# EAGLE design BGM111_A (EAGLE 7.5.0)
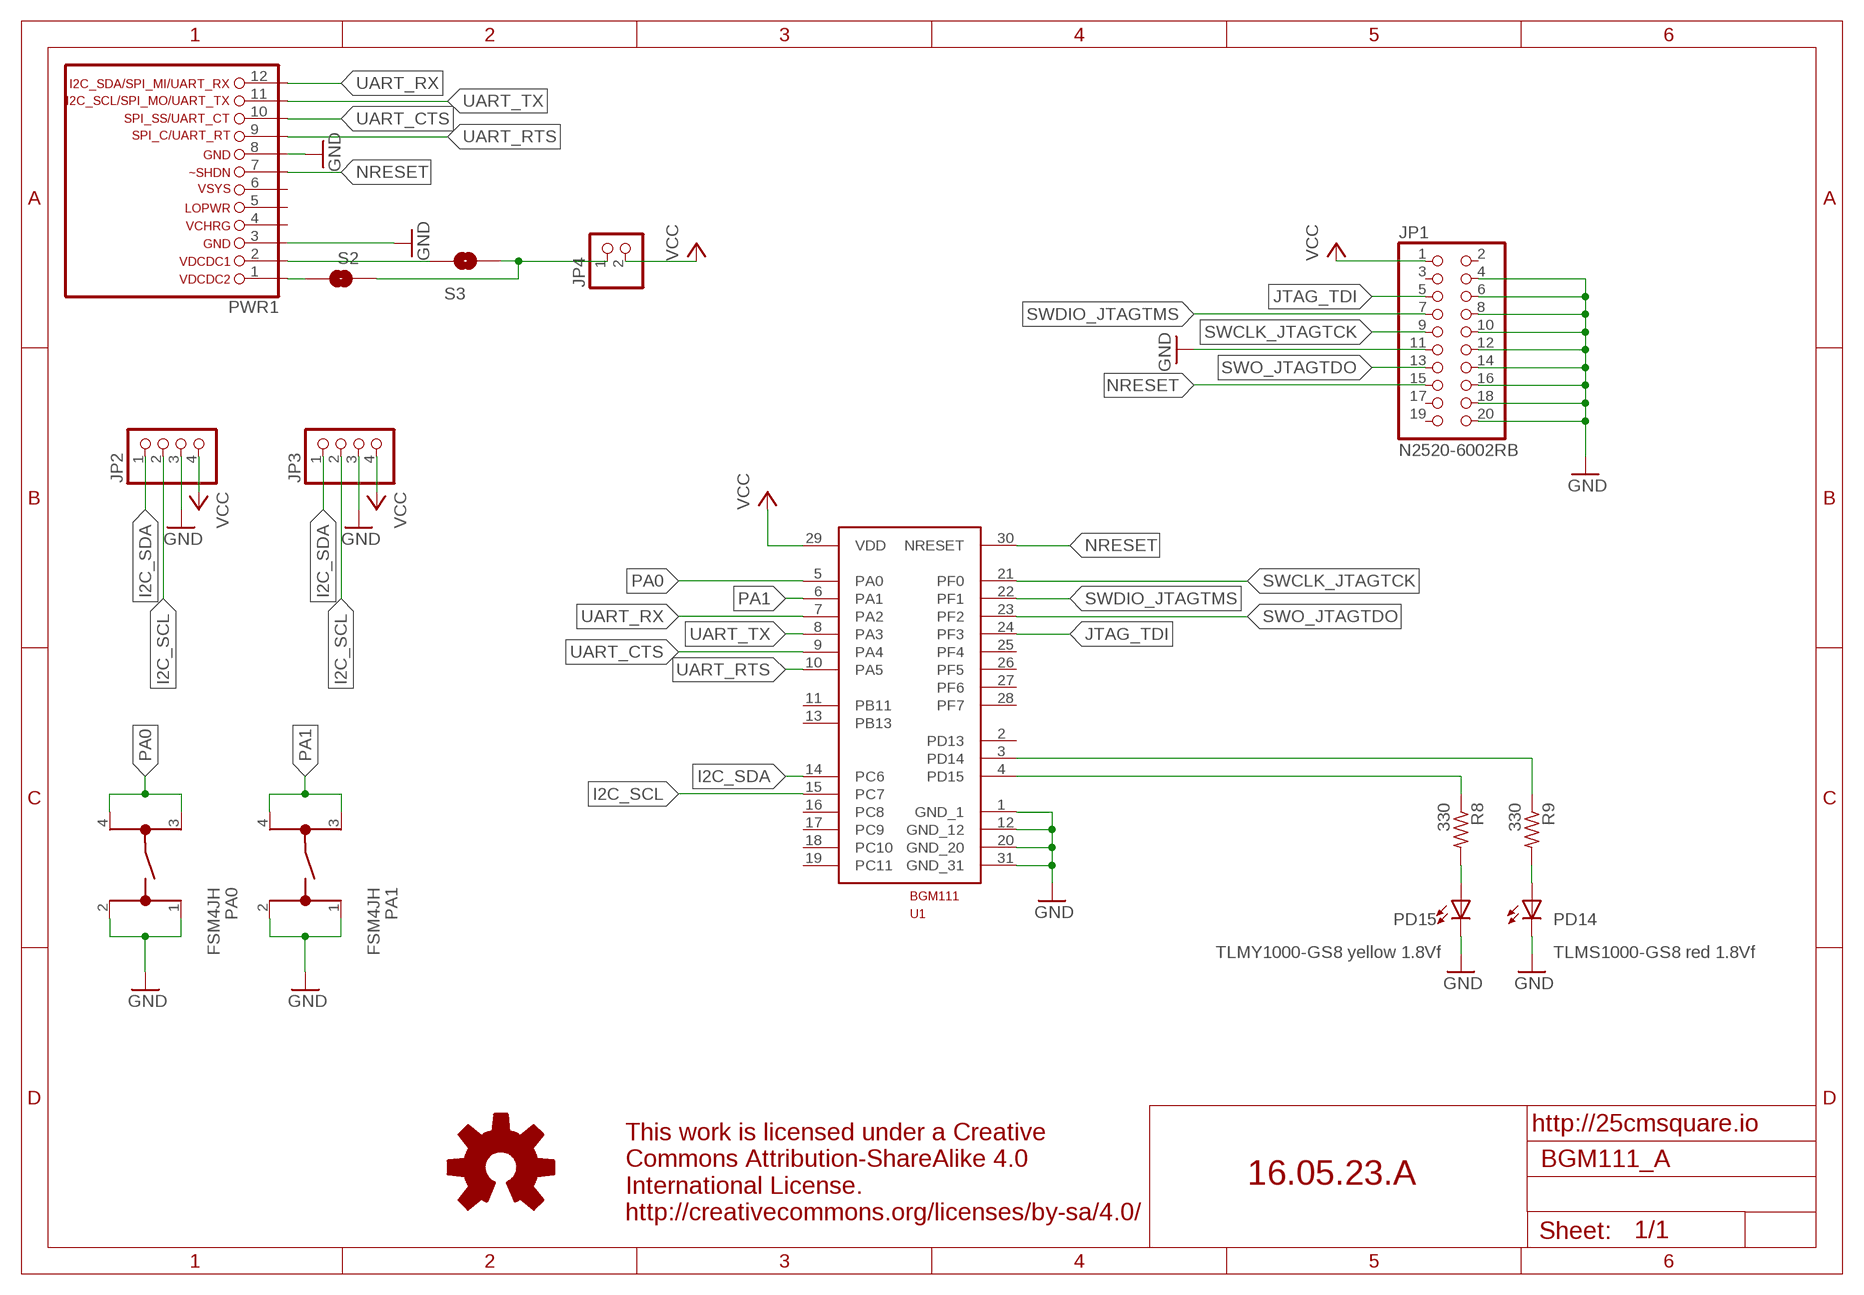
[diagram p0: schematic, sheet 1]

## Parts
JP1  N2520-6002RB  PINHD-2X10  [2X10]
JP2  PINHD-1X4  [1X04]
JP3  PINHD-1X4  [1X04]
JP4  PINHD-1X2  [1X02]
PA0  FSM4JH  [FSM4JH]
PA1  FSM4JH  [FSM4JH]
PD14  TLMS1000-GS8 red 1.8Vf  LEDSML0603  [SML0603]
PD15  TLMY1000-GS8 yellow 1.8Vf  LEDSML0603  [SML0603]
PWR1  LIWE_12_PIN_PWR  [LIWE_12_PIN]
R8  330  R-US_R0603  [R0603]
R9  330  R-US_R0603  [R0603]
S2  SOLDERJUMPERNC2  [SJ_2S-NOTRACE]
S3  SOLDERJUMPERNC2  [SJ_2S-NOTRACE]
U1  BGM111  [BGM111]
U$1  OSHW_LOGO  [OSHW]

## Nets
GND: JP1.4 JP1.6 JP1.8 JP1.10 JP1.11 JP1.12 JP1.14 JP1.16 JP1.18 JP1.20 JP2.3 JP3.3 PA0.1 PA0.2 PA1.1 PA1.2 PD14.C PD15.C PWR1.3 PWR1.8 U1.1(GND_1) U1.12(GND_12) U1.20(GND_20) U1.31(GND_31)
I2C_SCL: JP2.2 JP3.2 U1.15(PC7)
I2C_SDA: JP2.1 JP3.1 U1.14(PC6)
JTAG_TDI: JP1.5 U1.24(PF3)
N$1: PWR1.1 S2.1
N$2: PWR1.2 S3.1
N$3: JP4.1 S2.2 S3.2
N$4: PD14.A R9.2
N$5: PD15.A R8.2
NRESET: JP1.15 PWR1.7 U1.30(NRESET)
PA0: PA0.3 PA0.4 U1.5(PA0)
PA1: PA1.3 PA1.4 U1.6(PA1)
PF5: R9.1 U1.3(PD14)
PF6: R8.1 U1.4(PD15)
SWCLK_JTAGTCK: JP1.9 U1.21(PF0)
SWDIO_JTAGTMS: JP1.7 U1.22(PF1)
SWO_JTAGTDO: JP1.13 U1.23(PF2)
UART_CTS: PWR1.10 U1.9(PA4)
UART_RTS: PWR1.9 U1.10(PA5)
UART_RX: PWR1.12 U1.7(PA2)
UART_TX: PWR1.11 U1.8(PA3)
VCC: JP1.1 JP2.4 JP3.4 JP4.2 U1.29(VDD)
Unconnected: JP1.2 JP1.3 JP1.17 JP1.19 PWR1.4 PWR1.5 PWR1.6 U1.2(PD13) U1.11(PB11) U1.13(PB13) U1.16(PC8) U1.17(PC9) U1.18(PC10) U1.19(PC11) U1.25(PF4) U1.26(PF5) U1.27(PF6) U1.28(PF7)

## Notes on the sheet
- http://25cmsquare.io
- 16.05.23.A
- This work is licensed under a Creative
  Commons Attribution-ShareAlike 4.0
  International License.
  http://creativecommons.org/licenses/by-sa/4.0/

## Library data of the parts
JP1 = pinhead:PINHD-2X10: PIN HEADER
JP2 JP3 = pinhead:PINHD-1X4: PIN HEADER
JP4 = pinhead:PINHD-1X2: PIN HEADER
PA0 PA1 = 25cmsquare:FSM4JH: FSM4JH TE CONNECTIVITY / ALCOSWITCH http://sk.farnell.com/te-connectivity-alcoswitch/fsm4jh/switch-spno-0-05a/dp/1555982
PD14 PD15 = led:LED: LED OSRAM: - CHIPLED LG R971, LG N971, LY N971, LG Q971, LY Q971, LO R971, LY R971 LH N974, LH R974 LS Q976, LO Q976, LY Q976 LO Q996 - Hyper CHIPLED LW Q18S LB Q993, LB Q99A, LB R99A - SideLED LS A670, LO A670, LY A670, LG A670, LP A670 LB A673, LV A673, LT A673, LW A673 LH A674 LY A675 LS A676, LA A676, LO A676, LY A676, LW A676 LS A679, LY A679, LG A679 - Hyper Micro SIDELED® LS Y876, LA Y876, LO Y876, LY Y876 LT Y87S - SmartLED LW L88C, LW L88S LB L89C, LB L89S, LG L890 LS L89K, LO L89K, LY L89K LS L896, LA L896, LO L896, LY L896 - TOPLED LS T670, LO T670, LY T670, LG T670, LP T670 LSG T670, LSP T670, LSY T670, LOP T670, LYG T670 LG T671, LOG T671, LSG T671 LB T673, LV T673, LT T673, LW T673 LH T674 LS T676, LA T676, LO T676, LY T676, LB T676, LH T676, LSB T676, LW T676 LB T67C, LV T67C, LT T67C, LS T67K, LO T67K, LY T67K, LW E67C LS E67B, LA E67B, LO E67B, LY E67B, LB E67C, LV E67C, LT E67C LW T67C LS T679, LY T679, LG T679 LS T770, LO T770, LY T770, LG T770, LP T770 LB T773, LV T773, LT T773, LW T773 LH T774 LS E675, LA E675, LY E675, LS T675 LS T776, LA T776, LO T776, LY T776, LB T776 LHGB T686 LT T68C, LB T68C - Hyper Mini TOPLED® LB M676 - Mini TOPLED Santana® LG M470 LS M47K, LO M47K, LY M47K Source: http://www.osram.convergy.de LUXEON: - LUMILED® LXK2-PW12-R00, LXK2-PW12-S00, LXK2-PW14-U00, LXK2-PW14-V00 LXK2-PM12-R00, LXK2-PM12-S00, LXK2-PM14-U00 LXK2-PE12-Q00, LXK2-PE12-R00, LXK2-PE12-S00, LXK2-PE14-T00, LXK2-PE14-U00 LXK2-PB12-K00, LXK2-PB12-L00, LXK2-PB12-M00, LXK2-PB14-N00, LXK2-PB14-P00, LXK2-PB14-Q00 LXK2-PR12-L00, LXK2-PR12-M00, LXK2-PR14-Q00, LXK2-PR14-R00 LXK2-PD12-Q00, LXK2-PD12-R00, LXK2-PD12-S00 LXK2-PH12-R00, LXK2-PH12-S00 LXK2-PL12-P00, LXK2-PL12-Q00, LXK2-PL12-R00 Source: www.luxeon.com KINGBRIGHT: KA-3528ASYC Source: www.kingbright.com
PWR1 = 25cmsquare:LIWE_12_PIN_PWR
R8 R9 = resistor:R-US_: RESISTOR, American symbol
S2 S3 = SparkFun-Passives:SOLDERJUMPER: Solder Jumper Standard SMD solder jumper. Used to automate production. Two varients : Normally Open and Normally Closed are the same, but have different paste layers. NC will have a large amount of paste and should jumper during reflow.
U1 = 25cmsquare:BGM111: BGM111
U$1 = 25cmsquare:OSHW_LOGO

## Board
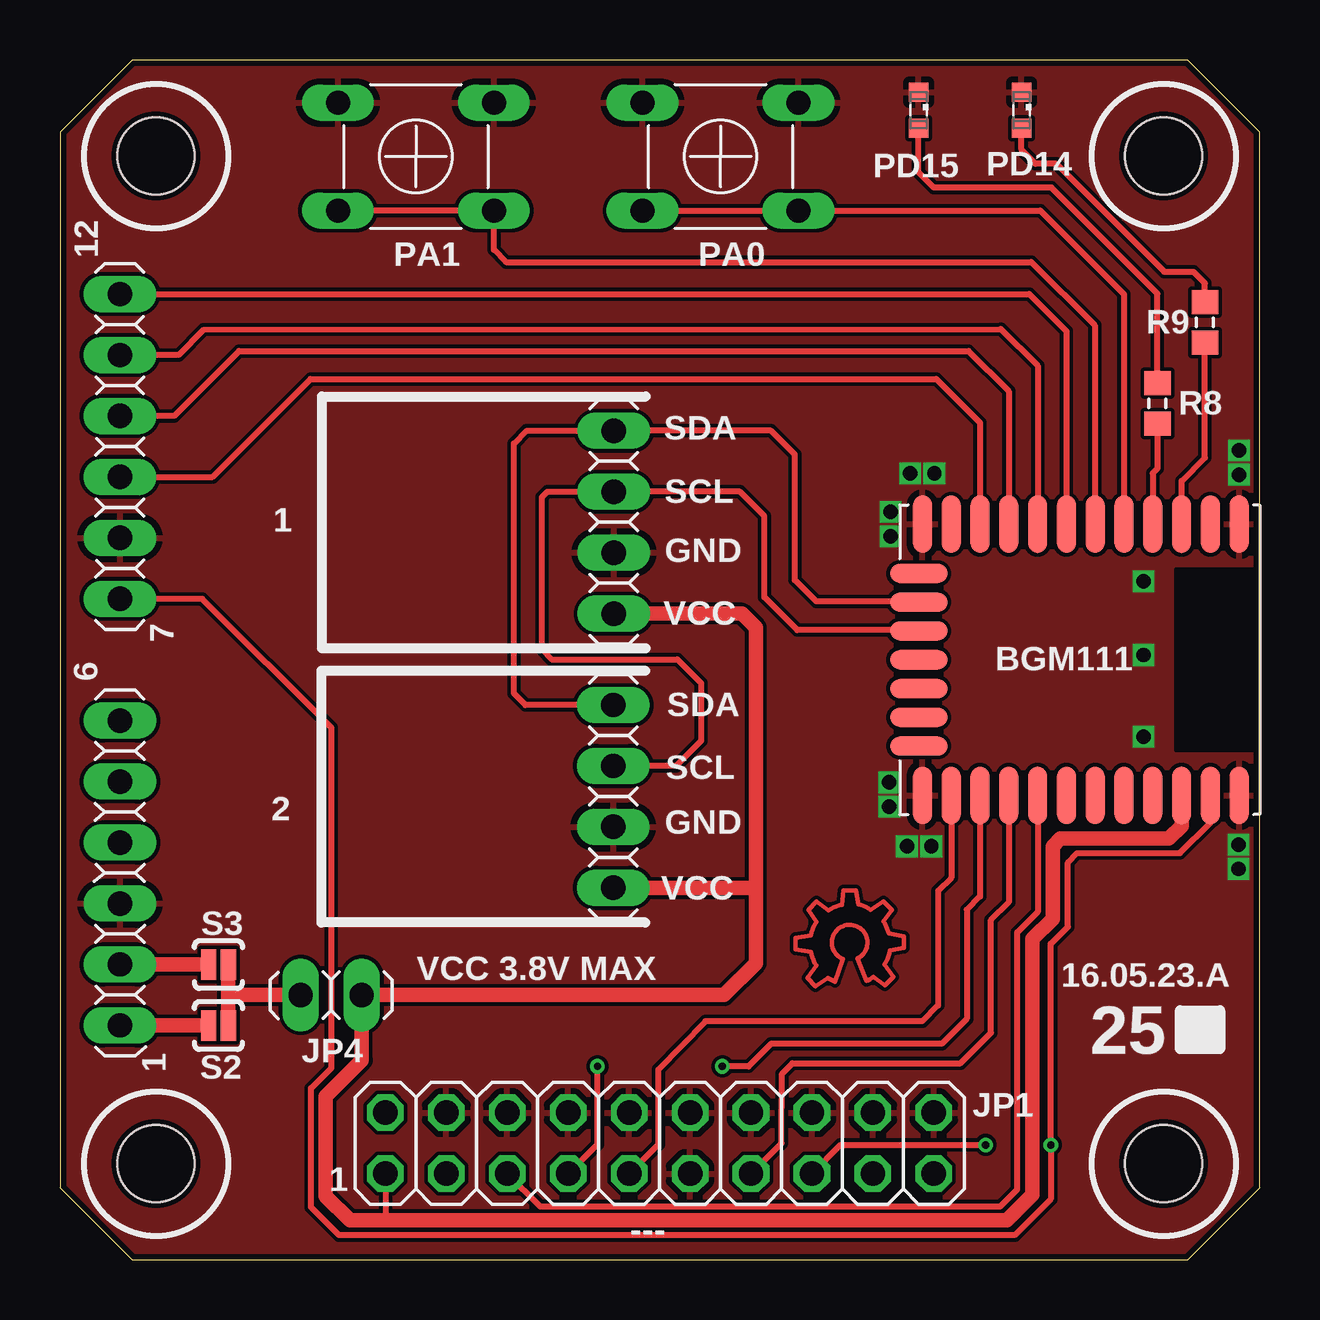
[diagram p1: board, top side]
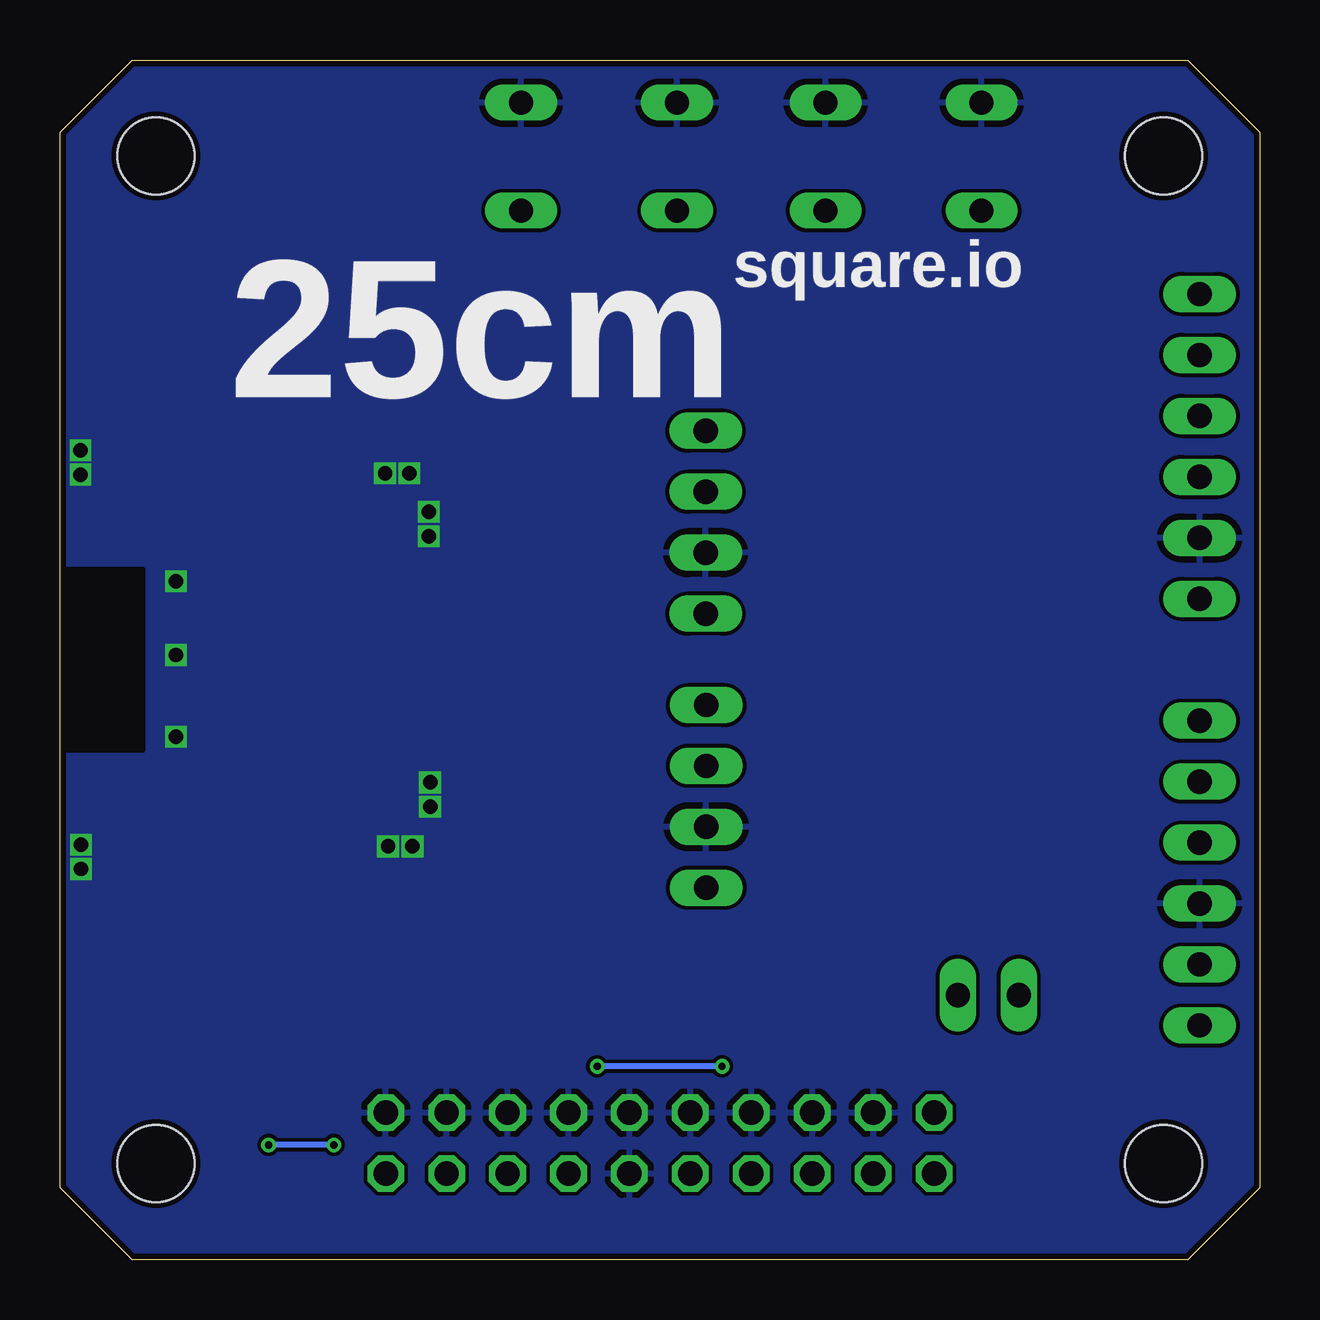
[diagram p2: board, bottom side, seen from below]

Size 50 x 50 mm. Coordinates in mm from the lower left corner, seen from the top.
Copper layers (1*16): Top 0.035mm / dielectric 1.5mm / Bottom 0.035mm
Design rules "SeeedStudio_2layer_DRU_no_angle_20140221": minimum track width 6mil, minimum drill 12mil, track to track 6mil, track to pad 6mil, pad to pad 6mil, via to via 6mil, smd to smd 0mil, copper to edge 10mil, drill to drill 10mil, minimum pad ring 10mil, minimum via ring 6mil, stop-mask expansion 2mil, vias tented up to drill 100mil, thermal gap 10mil

### Footprints (pad centres in the part's own frame; a part is rotated, then mirrored left to right if it is on the bottom)
2X10 = drill 1.016 octagon: 1 -11.43,-1.27; 2 -11.43,1.27; 3 -8.89,-1.27; 4 -8.89,1.27; 5 -6.35,-1.27; 6 -6.35,1.27; 7 -3.81,-1.27; 8 -3.81,1.27; 9 -1.27,-1.27; 10 -1.27,1.27; 11 1.27,-1.27; 12 1.27,1.27; 13 3.81,-1.27; 14 3.81,1.27; 15 6.35,-1.27; 16 6.35,1.27; 17 8.89,-1.27; 18 8.89,1.27; 19 11.43,-1.27; 20 11.43,1.27
1X04 = drill 1.016 long: 1 -3.81,0; 2 -1.27,0; 3 1.27,0; 4 3.81,0
1X02 = drill 1.016 long: 1 -1.27,0; 2 1.27,0
FSM4JH = drill 1 long: 1 -3.25,2.25; 2 3.25,2.25; 3 -3.25,-2.25; 4 3.25,-2.25
SML0603 = smd 0.8 x 0.8: A 0.75,0; C -0.75,0
LIWE_12_PIN = drill 1.016 long: 1 22.5,15.24; 2 22.5,12.7; 3 22.5,10.16; 4 22.5,7.62; 5 22.5,5.08; 6 22.5,2.54; 7 22.5,-2.54; 8 22.5,-5.08; 9 22.5,-7.62; 10 22.5,-10.16; 11 22.5,-12.7; 12 22.5,-15.24 | hole 3.2: -21,-21; 21,-21; -21,21; 21,21
R0603 = smd 1 x 1.1: 1 -0.85,0; 2 0.85,0
SJ_2S-NOTRACE = smd 0.635 x 1.27: 1 -0.401,0; 2 0.413,0
BGM111 = smd 2.4 x 0.8: 1 -5.65,14.15; 2 -5.65,12.95; 3 -5.65,11.75; 4 -5.65,10.55; 5 -5.65,9.35; 6 -5.65,8.15; 7 -5.65,6.95; 8 -5.65,5.75; 9 -5.65,4.55; 10 -5.65,3.35; 11 -5.65,2.15; 12 -5.65,0.95; 20 5.65,0.95; 21 5.65,2.15; 22 5.65,3.35; 23 5.65,4.55; 24 5.65,5.75; 25 5.65,6.95; 26 5.65,8.15; 27 5.65,9.35; 28 5.65,10.55; 29 5.65,11.75; 30 5.65,12.95; 31 5.65,14.15 | smd 0.8 x 2.4: 13 -3.6,0.8; 14 -2.4,0.8; 15 -1.2,0.8; 16 0,0.8; 17 1.2,0.8; 18 2.4,0.8; 19 3.6,0.8

### Placement (x,y rotation side)
JP1  24.99,4.85 0 top
JP2  23.09,30.73 270 top
JP3  23.06,19.3 270 top
JP4  11.3,11.02 0 top
PA0  27.53,45.97 0 top
PA1  14.83,45.97 0 top
PD14  40.08,47.9 270 top
PD15  35.79,47.9 270 top
PWR1  25,25 180 top
R8  45.75,35.69 90 top
R9  47.73,39.07 90 top
S2  6.6,9.75 0 top
S3  6.6,12.29 0 top
U1  35,25 270 top
U$1  32.92,12.7 0 top

### Tracks (layer width: path | path; a pad name or v marks a point on that pad's centre or on a via)
GND  (via drill 0.6)
  other vias: 35.43,32.77 34.62,31.17 36.45,32.77 34.62,30.15 49.15,33.73 49.15,32.72 36.32,17.22 34.57,19.89 35.31,17.22 34.57,18.87 49.12,17.3 49.12,16.28 45.16,28.27 45.16,25.2 45.16,21.79
  pour Bottom: -2.67,51.16 53.44,51.16 53.44,-3.45 -2.67,-3.45
  pour Top: -17.12,59.21 67.16,59.21 67.16,-24.64 -17.12,-24.64
I2C_SCL
  Top 0.254: JP3.2 25.68,20.57 26.72,21.61 26.72,24.03 25.73,25.02 20.5,25.02 20.09,25.43 20.09,31.77 20.32,32 JP2.2 28.35,32 29.36,30.99 29.36,27.61 30.73,26.24 35.76,26.24 U1.15
I2C_SDA
  Top 0.254: JP3.1 19.41,23.11 18.92,23.6 18.92,34.01 19.46,34.54 JP2.1 29.64,34.54 30.63,33.55 30.63,28.32 31.52,27.43 35.77,27.43 U1.14
JTAG_TDI
  Top 0.254: U1.24 40.75,14.49 39.9,13.64 39.9,2.92 39.19,2.21 20.02,2.21 JP1.5
N$1
  Top 0.61: PWR1.1 S2.1
N$2
  Top 0.61: PWR1.2 S3.1
N$3
  Top 0.61: S2.2 S3.2 7.02,11.02 JP4.1
N$4
  Top 0.254: R9.2 47.73,40.69 47.24,41.17 46.02,41.17 41.53,45.67 40.66,45.67 40.08,46.25 PD14.A
N$5
  Top 0.254: R8.2 45.74,40.26 41.33,44.68 36.42,44.68 35.79,45.31 PD15.A
NRESET  (via drill 0.3)
  Top 0.254: PWR1.7 5.94,27.54 11.3,22.17 11.3,7.98 10.46,7.14 10.46,2.18 11.63,1.02 39.8,1.02 41.3,2.52 v41.3,4.78 41.3,13.16 42.01,13.87 42.01,16.56 42.39,16.94 46.69,16.94 47.95,18.21 U1.30 | v38.58,4.78 32.54,4.78 JP1.15
  Bottom 0.254: v38.58,4.78 v41.3,4.78
PA0
  Top 0.254: PA0.3 PA0.4 40.86,43.72 44.35,40.23 U1.5
PA1
  Top 0.254: PA1.3 PA1.4 18.09,42.09 18.59,41.58 40.49,41.58 43.13,38.94 43.13,30.67 U1.6
PF5
  Top 0.254: U1.3 46.75,32.45 47.73,33.43 R9.1
PF6
  Top 0.254: 45.55,34.83 R8.1 45.74,32.97 45.55,32.77 U1.4
SWCLK_JTAGTCK
  Top 0.254: U1.21 37.15,15.92 36.6,15.37 36.6,10.59 35.94,9.93 26.9,9.93 24.94,7.92 24.94,4.8 JP1.9
SWDIO_JTAGTMS  (via drill 0.3)
  Top 0.254: U1.22 38.35,15.13 37.8,14.58 37.8,10.03 36.75,8.99 29.64,8.99 28.7,8.05 v27.61,8.05 | v22.4,8.05 22.4,4.8 JP1.7
  Bottom 0.254: v22.4,8.05 v27.61,8.05
SWO_JTAGTDO
  Top 0.254: U1.23 39.55,14.89 38.81,14.15 38.81,9.45 37.54,8.18 30.53,8.18 30.1,7.75 30.07,4.85 JP1.13
UART_CTS
  Top 0.254: U1.9 39.55,36.19 37.87,37.87 7.47,37.87 4.76,35.16 PWR1.10
UART_RTS
  Top 0.254: U1.10 38.35,34.88 36.52,36.7 10.44,36.7 6.36,32.62 PWR1.9
UART_RX
  Top 0.254: PWR1.12 40.41,40.24 41.95,38.7 U1.7
UART_TX
  Top 0.254: U1.8 40.75,37.25 39.22,38.79 6,38.76 4.94,37.7 PWR1.11
VCC
  Top 0.254: JP1.1 13.56,1.63
  Top 0.61: 46.76,19.34 U1.29 46.75,18.07 46.23,17.55 41.71,17.55 41.38,17.22 41.38,14.2 40.54,13.36 40.54,2.69 39.47,1.63 13.56,1.63 12.09,1.63 11.07,2.64 11.07,6.81 12.57,8.31 JP4.2 27.69,11.02 29.01,12.34 29.01,15.49 | 29.01,15.49 29.01,26.34 28.42,26.92 JP2.4 | JP3.4 29.01,15.49

### Text on the board
tNames: 12 | SDA | SCL | 1 | GND | 7 | VCC | 6 | SDA | SCL | 2 | GND | VCC | VCC 3.8V MAX | 16.05.23.A | 25 | 1 | 1 | ---
bNames: 25cm | square.io